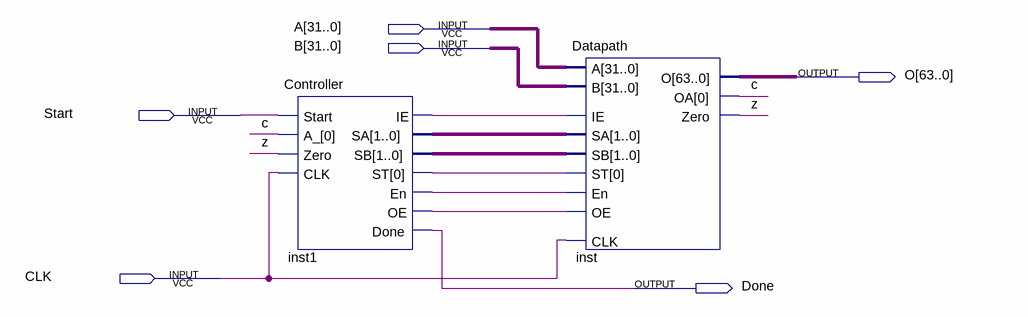
[diagram p0: schematic sheet]
// Quartus schematic VXL.bdf as structural Verilog: 2 symbols, 6 pins
module VXL (
  input  [31:0] A,
  input  [31:0] B,
  input  Start,
  input  CLK,
  output [63:0] O,
  output Done
);

  wire c, inst1_en, inst1_ie, inst1_oe, inst1_st, z;
  wire [1:0] inst1_sa, inst1_sb;

  Controller inst1 (
    .Start(Start), .A_(c), .Zero(z), .CLK(CLK), .IE(inst1_ie), .SA(inst1_sa), .SB(inst1_sb), .ST(inst1_st),
    .En(inst1_en), .OE(inst1_oe), .Done(Done));
  Datapath inst (
    .ST(inst1_st), .OE(inst1_oe), .IE(inst1_ie), .SA(inst1_sa), .A(A), .SB(inst1_sb), .B(B), .CLK(CLK),
    .En(inst1_en), .O(O), .OA(c), .Zero(z));
endmodule
